# Altium schematic sheet 16.RK3588_MIPI  Interface.SchDoc
size 430 x 350 mm; Revision: V2.1; Schematic Page Number: 11; Page Number: 16; Check: <Checker>; Schematic Name: RK_NVR_DEMO1_RK3588_LP4/4x_V21; Page Count: 43; Page name: 16.RK3588_MIPI  Interface; Designer: Zhangdz; Schematic Page Count: 99; Revcode: V2.1; DsnPath: E:\Work\SBER\RK3588_SOM\temp\RK_NVR_DEMO1_RK3588_LP4XD200P232SD8_V21_20211228.DSN; SchematicName: RK_NVR_DEMO1_RK3588_LP4/4x_V21; PageName: 16.RK3588_MIPI  Interface; PageSize: Custom; TopSchematic: True
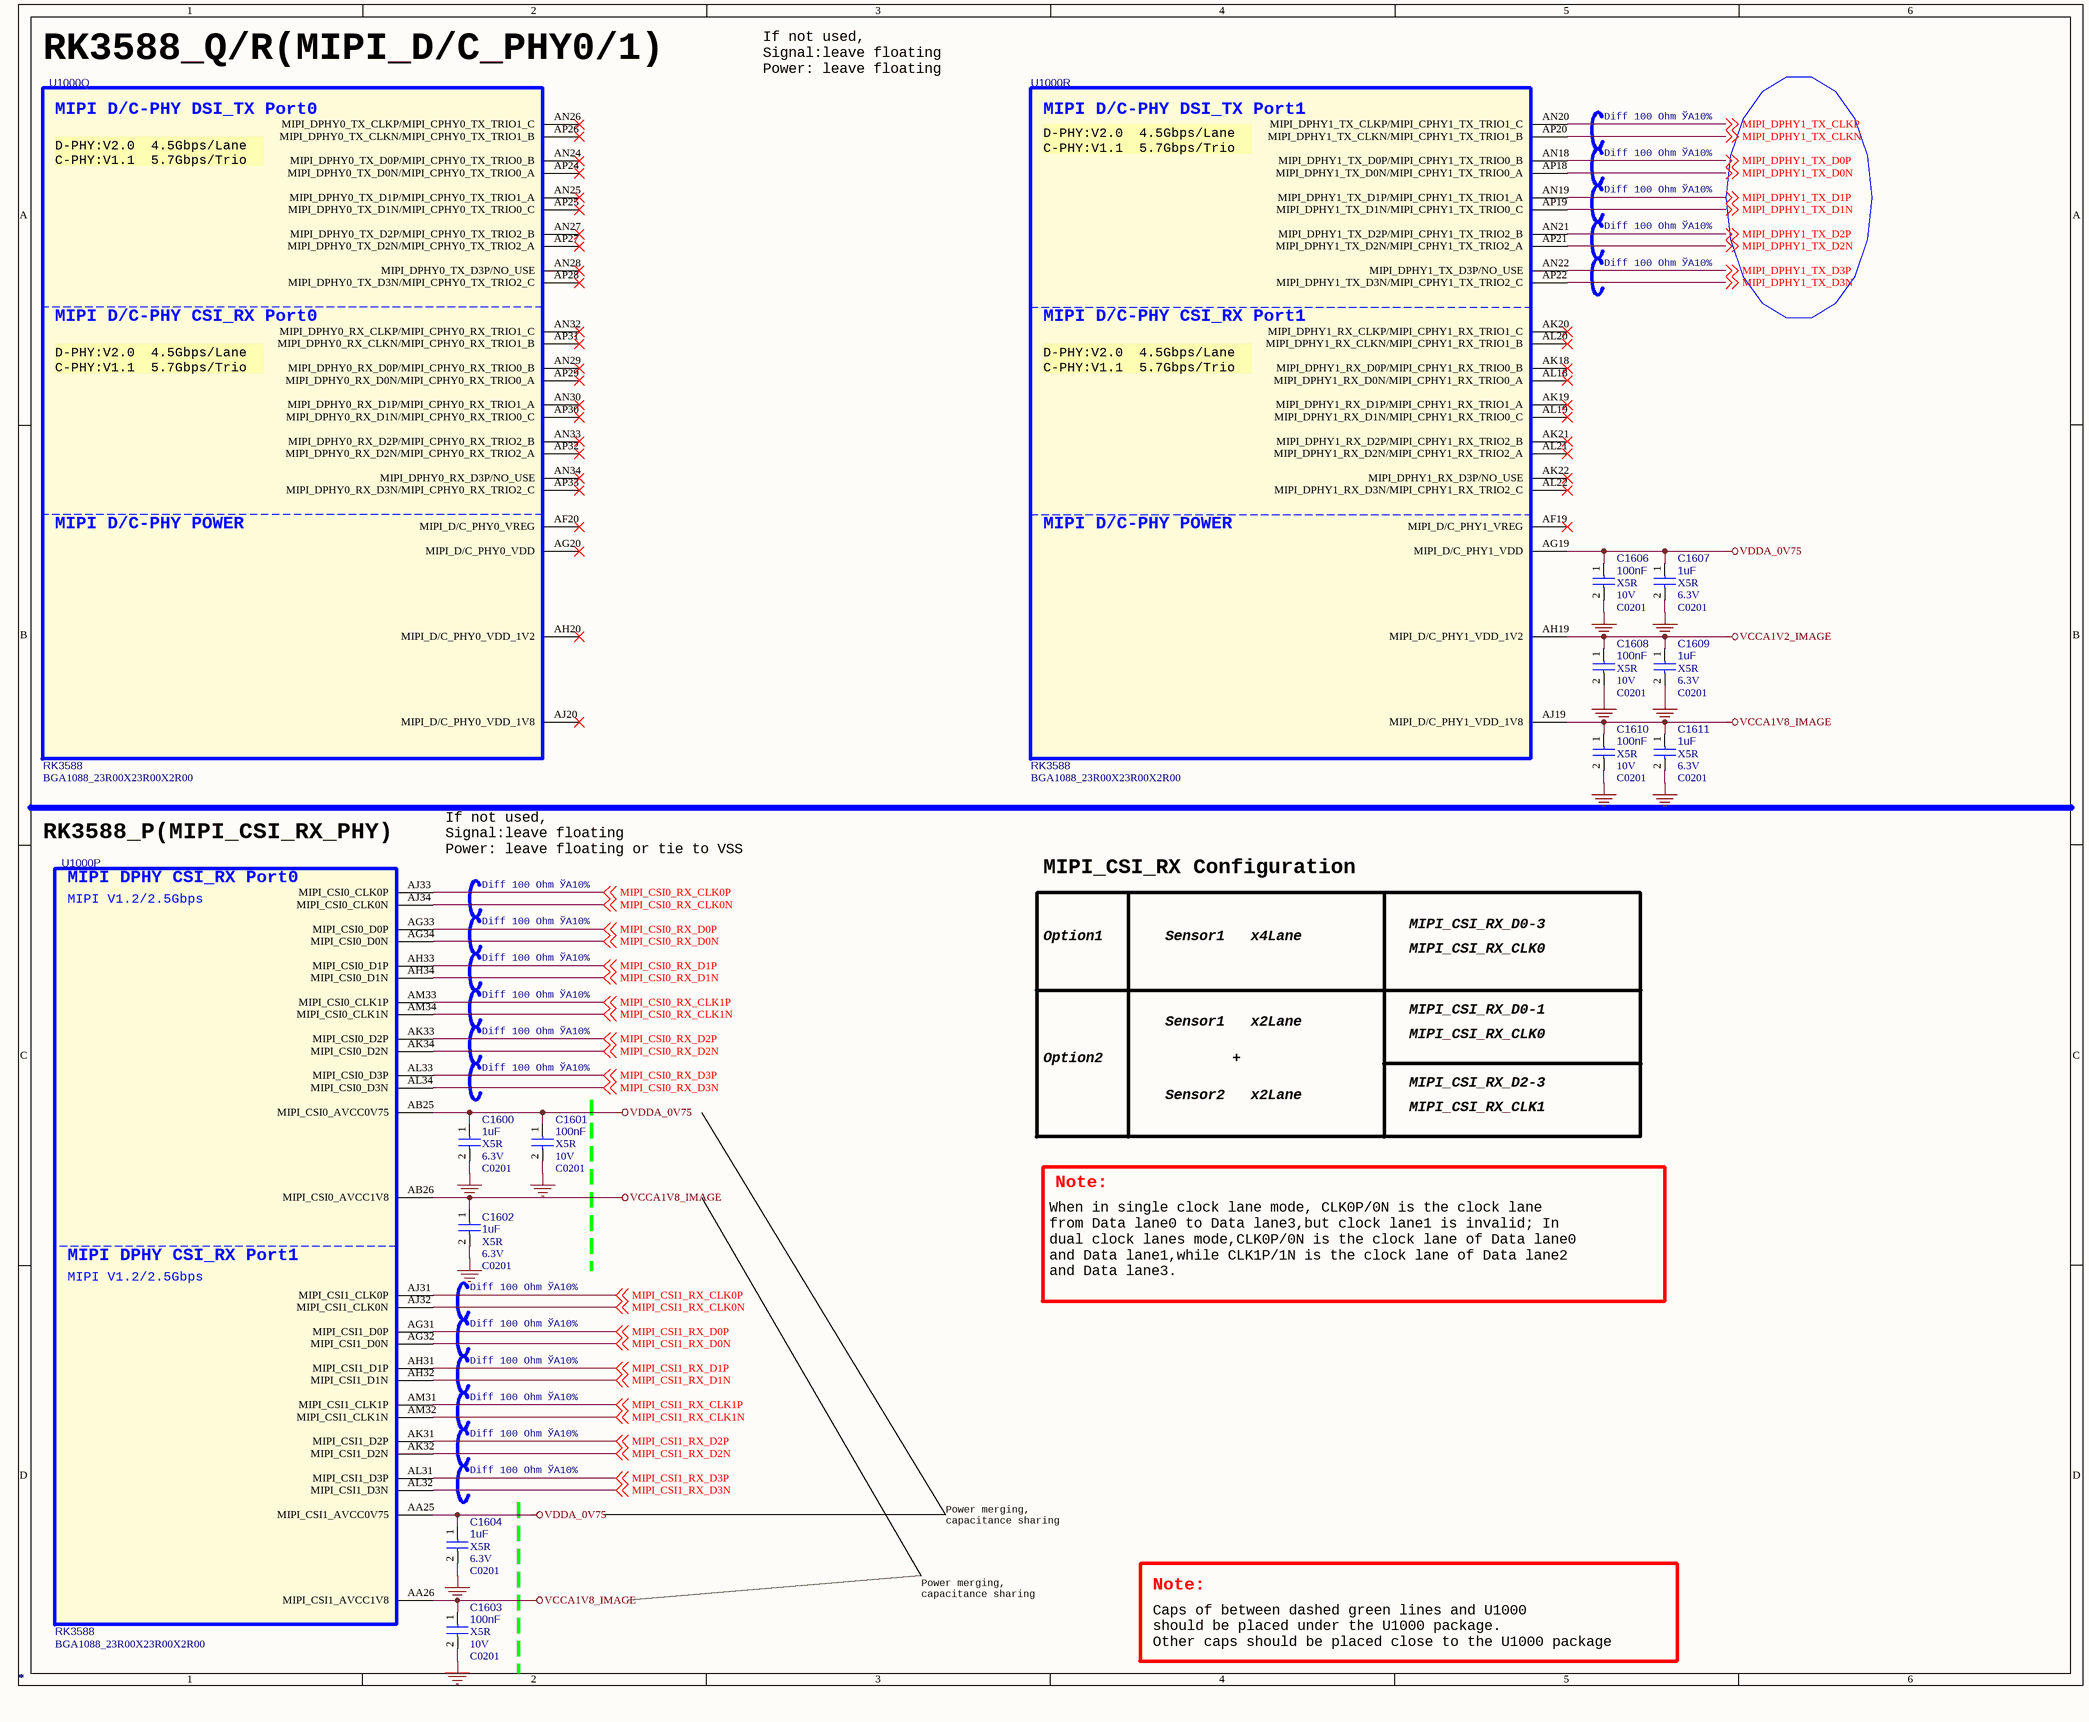
[diagram p0: 16.RK3588_MIPI  Interface.SchDoc]

## Parts
C1600  *  Voltage: 6.3V  Dielectric: X5R  [C0201]
C1601  *  Voltage: 10V  Dielectric: X5R  [C0201]
C1602  *  Voltage: 6.3V  Dielectric: X5R  [C0201]
C1603  *  Voltage: 10V  Dielectric: X5R  [C0201]
C1604  *  Voltage: 6.3V  Dielectric: X5R  [C0201]
C1606  *  Voltage: 10V  Dielectric: X5R  [C0201]
C1607  *  Voltage: 6.3V  Dielectric: X5R  [C0201]
C1608  *  Voltage: 10V  Dielectric: X5R  [C0201]
C1609  *  Voltage: 6.3V  Dielectric: X5R  [C0201]
C1610  *  Voltage: 10V  Dielectric: X5R  [C0201]
C1611  *  Voltage: 6.3V  Dielectric: X5R  [C0201]
U1000  *  [BGA1088_23R00X23R00X2R00]  (parts P,Q,R of 26)

## Nets
GND: C1600.2 C1601.2 C1602.2 C1603.2 C1604.2 C1606.2 C1607.2 C1608.2 C1609.2 C1610.2 C1611.2
VCCA1V2_IMAGE: C1608.1 C1609.1 U1000.AH19(MIPI_D/C_PHY1_VDD_1V2)
VCCA1V8_IMAGE: C1602.1 C1603.1 C1610.1 C1611.1 U1000.AA26(MIPI_CSI1_AVCC1V8) U1000.AB26(MIPI_CSI0_AVCC1V8) U1000.AJ19(MIPI_D/C_PHY1_VDD_1V8)
VDDA_0V75: C1600.1 C1601.1 C1604.1 C1606.1 C1607.1 U1000.AA25(MIPI_CSI1_AVCC0V75) U1000.AB25(MIPI_CSI0_AVCC0V75) U1000.AG19(MIPI_D/C_PHY1_VDD)
MIPI_CSI0_RX_CLK0N: U1000.AJ34(MIPI_CSI0_CLK0N) ; off-sheet MIPI_CSI0_RX_CLK0N
MIPI_CSI0_RX_CLK0P: U1000.AJ33(MIPI_CSI0_CLK0P) ; off-sheet MIPI_CSI0_RX_CLK0P
MIPI_CSI0_RX_CLK1N: U1000.AM34(MIPI_CSI0_CLK1N) ; off-sheet MIPI_CSI0_RX_CLK1N
MIPI_CSI0_RX_CLK1P: U1000.AM33(MIPI_CSI0_CLK1P) ; off-sheet MIPI_CSI0_RX_CLK1P
MIPI_CSI0_RX_D0N: U1000.AG34(MIPI_CSI0_D0N) ; off-sheet MIPI_CSI0_RX_D0N
MIPI_CSI0_RX_D0P: U1000.AG33(MIPI_CSI0_D0P) ; off-sheet MIPI_CSI0_RX_D0P
MIPI_CSI0_RX_D1N: U1000.AH34(MIPI_CSI0_D1N) ; off-sheet MIPI_CSI0_RX_D1N
MIPI_CSI0_RX_D1P: U1000.AH33(MIPI_CSI0_D1P) ; off-sheet MIPI_CSI0_RX_D1P
MIPI_CSI0_RX_D2N: U1000.AK34(MIPI_CSI0_D2N) ; off-sheet MIPI_CSI0_RX_D2N
MIPI_CSI0_RX_D2P: U1000.AK33(MIPI_CSI0_D2P) ; off-sheet MIPI_CSI0_RX_D2P
MIPI_CSI0_RX_D3N: U1000.AL34(MIPI_CSI0_D3N) ; off-sheet MIPI_CSI0_RX_D3N
MIPI_CSI0_RX_D3P: U1000.AL33(MIPI_CSI0_D3P) ; off-sheet MIPI_CSI0_RX_D3P
MIPI_CSI1_RX_CLK0N: U1000.AJ32(MIPI_CSI1_CLK0N) ; off-sheet MIPI_CSI1_RX_CLK0N
MIPI_CSI1_RX_CLK0P: U1000.AJ31(MIPI_CSI1_CLK0P) ; off-sheet MIPI_CSI1_RX_CLK0P
MIPI_CSI1_RX_CLK1N: U1000.AM32(MIPI_CSI1_CLK1N) ; off-sheet MIPI_CSI1_RX_CLK1N
MIPI_CSI1_RX_CLK1P: U1000.AM31(MIPI_CSI1_CLK1P) ; off-sheet MIPI_CSI1_RX_CLK1P
MIPI_CSI1_RX_D0N: U1000.AG32(MIPI_CSI1_D0N) ; off-sheet MIPI_CSI1_RX_D0N
MIPI_CSI1_RX_D0P: U1000.AG31(MIPI_CSI1_D0P) ; off-sheet MIPI_CSI1_RX_D0P
MIPI_CSI1_RX_D1N: U1000.AH32(MIPI_CSI1_D1N) ; off-sheet MIPI_CSI1_RX_D1N
MIPI_CSI1_RX_D1P: U1000.AH31(MIPI_CSI1_D1P) ; off-sheet MIPI_CSI1_RX_D1P
MIPI_CSI1_RX_D2N: U1000.AK32(MIPI_CSI1_D2N) ; off-sheet MIPI_CSI1_RX_D2N
MIPI_CSI1_RX_D2P: U1000.AK31(MIPI_CSI1_D2P) ; off-sheet MIPI_CSI1_RX_D2P
MIPI_CSI1_RX_D3N: U1000.AL32(MIPI_CSI1_D3N) ; off-sheet MIPI_CSI1_RX_D3N
MIPI_CSI1_RX_D3P: U1000.AL31(MIPI_CSI1_D3P) ; off-sheet MIPI_CSI1_RX_D3P
MIPI_DPHY1_TX_CLKN: U1000.AP20(MIPI_DPHY1_TX_CLKN/MIPI_CPHY1_TX_TRIO1_B) ; off-sheet MIPI_DPHY1_TX_CLKN
MIPI_DPHY1_TX_CLKP: U1000.AN20(MIPI_DPHY1_TX_CLKP/MIPI_CPHY1_TX_TRIO1_C) ; off-sheet MIPI_DPHY1_TX_CLKP
MIPI_DPHY1_TX_D0N: U1000.AP18(MIPI_DPHY1_TX_D0N/MIPI_CPHY1_TX_TRIO0_A) ; off-sheet MIPI_DPHY1_TX_D0N
MIPI_DPHY1_TX_D0P: U1000.AN18(MIPI_DPHY1_TX_D0P/MIPI_CPHY1_TX_TRIO0_B) ; off-sheet MIPI_DPHY1_TX_D0P
MIPI_DPHY1_TX_D1N: U1000.AP19(MIPI_DPHY1_TX_D1N/MIPI_CPHY1_TX_TRIO0_C) ; off-sheet MIPI_DPHY1_TX_D1N
MIPI_DPHY1_TX_D1P: U1000.AN19(MIPI_DPHY1_TX_D1P/MIPI_CPHY1_TX_TRIO1_A) ; off-sheet MIPI_DPHY1_TX_D1P
MIPI_DPHY1_TX_D2N: U1000.AP21(MIPI_DPHY1_TX_D2N/MIPI_CPHY1_TX_TRIO2_A) ; off-sheet MIPI_DPHY1_TX_D2N
MIPI_DPHY1_TX_D2P: U1000.AN21(MIPI_DPHY1_TX_D2P/MIPI_CPHY1_TX_TRIO2_B) ; off-sheet MIPI_DPHY1_TX_D2P
MIPI_DPHY1_TX_D3N: U1000.AP22(MIPI_DPHY1_TX_D3N/MIPI_CPHY1_TX_TRIO2_C) ; off-sheet MIPI_DPHY1_TX_D3N
MIPI_DPHY1_TX_D3P: U1000.AN22(MIPI_DPHY1_TX_D3P/NO_USE) ; off-sheet MIPI_DPHY1_TX_D3P

Not connected (* = marked no-connect by the designer): U1000 AF19(MIPI_D/C_PHY1_VREG)* AF20(MIPI_D/C_PHY0_VREG)* AG20(MIPI_D/C_PHY0_VDD)* AH20(MIPI_D/C_PHY0_VDD_1V2)* AJ20(MIPI_D/C_PHY0_VDD_1V8)* AK18(MIPI_DPHY1_RX_D0P/MIPI_CPHY1_RX_TRIO0_B)* AK19(MIPI_DPHY1_RX_D1P/MIPI_CPHY1_RX_TRIO1_A)* AK20(MIPI_DPHY1_RX_CLKP/MIPI_CPHY1_RX_TRIO1_C)* AK21(MIPI_DPHY1_RX_D2P/MIPI_CPHY1_RX_TRIO2_B)* AK22(MIPI_DPHY1_RX_D3P/NO_USE)* AL18(MIPI_DPHY1_RX_D0N/MIPI_CPHY1_RX_TRIO0_A)* AL19(MIPI_DPHY1_RX_D1N/MIPI_CPHY1_RX_TRIO0_C)* AL20(MIPI_DPHY1_RX_CLKN/MIPI_CPHY1_RX_TRIO1_B)* AL21(MIPI_DPHY1_RX_D2N/MIPI_CPHY1_RX_TRIO2_A)* AL22(MIPI_DPHY1_RX_D3N/MIPI_CPHY1_RX_TRIO2_C)* AN24(MIPI_DPHY0_TX_D0P/MIPI_CPHY0_TX_TRIO0_B)* AN25(MIPI_DPHY0_TX_D1P/MIPI_CPHY0_TX_TRIO1_A)* AN26(MIPI_DPHY0_TX_CLKP/MIPI_CPHY0_TX_TRIO1_C)* AN27(MIPI_DPHY0_TX_D2P/MIPI_CPHY0_TX_TRIO2_B)* AN28(MIPI_DPHY0_TX_D3P/NO_USE)* AN29(MIPI_DPHY0_RX_D0P/MIPI_CPHY0_RX_TRIO0_B)* AN30(MIPI_DPHY0_RX_D1P/MIPI_CPHY0_RX_TRIO1_A)* AN32(MIPI_DPHY0_RX_CLKP/MIPI_CPHY0_RX_TRIO1_C)* AN33(MIPI_DPHY0_RX_D2P/MIPI_CPHY0_RX_TRIO2_B)* AN34(MIPI_DPHY0_RX_D3P/NO_USE)* AP24(MIPI_DPHY0_TX_D0N/MIPI_CPHY0_TX_TRIO0_A)* AP25(MIPI_DPHY0_TX_D1N/MIPI_CPHY0_TX_TRIO0_C)* AP26(MIPI_DPHY0_TX_CLKN/MIPI_CPHY0_TX_TRIO1_B)* AP27(MIPI_DPHY0_TX_D2N/MIPI_CPHY0_TX_TRIO2_A)* AP28(MIPI_DPHY0_TX_D3N/MIPI_CPHY0_TX_TRIO2_C)* AP29(MIPI_DPHY0_RX_D0N/MIPI_CPHY0_RX_TRIO0_A)* AP30(MIPI_DPHY0_RX_D1N/MIPI_CPHY0_RX_TRIO0_C)* AP31(MIPI_DPHY0_RX_CLKN/MIPI_CPHY0_RX_TRIO1_B)* AP32(MIPI_DPHY0_RX_D2N/MIPI_CPHY0_RX_TRIO2_A)* AP33(MIPI_DPHY0_RX_D3N/MIPI_CPHY0_RX_TRIO2_C)*

## Notes on the sheet
- RK3588_Q/R(MIPI_D/C_PHY0/1)
- If not used,
  Signal:leave floating
  Power: leave floating
- Diff 100 Ohm ЎА10%
- RK3588_P(MIPI_CSI_RX_PHY)
- If not used,
  Signal:leave floating
  Power: leave floating or tie to VSS
- MIPI_CSI_RX Configuration
- Option1
- Sensor1
- x4Lane
- MIPI_CSI_RX_D0-3
- MIPI_CSI_RX_CLK0
- x2Lane
- MIPI_CSI_RX_D0-1
- Option2
- Sensor2
- +
- MIPI_CSI_RX_D2-3
- MIPI_CSI_RX_CLK1
- Note:
- When in single clock lane mode, CLK0P/0N is the clock lane
  from Data lane0 to Data lane3,but clock lane1 is invalid; In
  dual clock lanes mode,CLK0P/0N is the clock lane of Data lane0
  and Data lane1,while CLK1P/1N is the clock lane of Data lane2
  and Data lane3.
- Power merging,
  capacitance sharing
- Caps of between dashed green lines and U1000
  should be placed under the U1000 package.
  Other caps should be placed close to the U1000 package
- (in symbol SOC_RK3588, part P) MIPI DPHY CSI_RX Port0; MIPI V1.2/2.5Gbps; MIPI DPHY CSI_RX Port1
- (in symbol SOC_RK3588, part Q) MIPI D/C-PHY DSI_TX Port0; D-PHY:V2.0  4.5Gbps/Lane / C-PHY:V1.1  5.7Gbps/Trio; MIPI D/C-PHY CSI_RX Port0; MIPI D/C-PHY POWER
- (in symbol SOC_RK3588, part R) MIPI D/C-PHY DSI_TX Port1; D-PHY:V2.0  4.5Gbps/Lane / C-PHY:V1.1  5.7Gbps/Trio; MIPI D/C-PHY CSI_RX Port1; MIPI D/C-PHY POWER

## Library data of the parts
C1600 = CAP NP: cap,1.00uF,+/-20%,6.3V,X5R,C0201; Part Reference: C1600; Manufacturer: TDK; Value: 1uF; RK PN: C0603X5R0J105M030BC; Priority: A; Tolerance: 20%; PCB Footprint: C0201; Part Type: C0201; Manufacturer PN: C0603X5R0J105M030BC; Created by: JJJ
C1601 = CAP NP: cap,100.00nF,+/-10%,10V,X5R,C0201; Part Reference: C1601; Manufacturer: TDK; Value: 100nF; RK PN: C0603X5R1A104K030BC; Priority: A; Tolerance: 10%; PCB Footprint: C0201; Part Type: C0201; Manufacturer PN: C0603X5R1A104K030BC; Created by: JJJ
C1602 = CAP NP: cap,1.00uF,+/-20%,6.3V,X5R,C0201; Part Reference: C1602; Manufacturer: TDK; Value: 1uF; RK PN: C0603X5R0J105M030BC; Priority: A; Tolerance: 20%; PCB Footprint: C0201; Part Type: C0201; Manufacturer PN: C0603X5R0J105M030BC; Created by: JJJ
C1603 = CAP NP: cap,100.00nF,+/-10%,10V,X5R,C0201; Part Reference: C1603; Manufacturer: TDK; Value: 100nF; RK PN: C0603X5R1A104K030BC; Priority: A; Tolerance: 10%; PCB Footprint: C0201; Part Type: C0201; Manufacturer PN: C0603X5R1A104K030BC; Created by: JJJ
C1604 = CAP NP: cap,1.00uF,+/-20%,6.3V,X5R,C0201; Part Reference: C1604; Manufacturer PN: C0603X5R0J105M030BC; Manufacturer: TDK; Value: 1uF; Tolerance: 20%; Priority: A; PCB Footprint: C0201; Created by: JJJ; Part Type: C0201; RK PN: C0603X5R0J105M030BC
C1606 = CAP NP: cap,100.00nF,+/-10%,10V,X5R,C0201; Part Reference: C1606; Manufacturer PN: C0603X5R1A104K030BC; Manufacturer: TDK; Value: 100nF; Tolerance: 10%; Priority: A; PCB Footprint: C0201; Created by: JJJ; Part Type: C0201; RK PN: C0603X5R1A104K030BC
C1607 = CAP NP: cap,1.00uF,+/-20%,6.3V,X5R,C0201; Part Reference: C1607; Manufacturer: TDK; Value: 1uF; RK PN: C0603X5R0J105M030BC; Priority: A; Tolerance: 20%; PCB Footprint: C0201; Part Type: C0201; Manufacturer PN: C0603X5R0J105M030BC; Created by: JJJ
C1608 = CAP NP: cap,100.00nF,+/-10%,10V,X5R,C0201; Part Reference: C1608; Manufacturer PN: C0603X5R1A104K030BC; Manufacturer: TDK; Value: 100nF; Tolerance: 10%; Priority: A; PCB Footprint: C0201; Created by: JJJ; Part Type: C0201; RK PN: C0603X5R1A104K030BC
C1609 = CAP NP: cap,1.00uF,+/-20%,6.3V,X5R,C0201; Part Reference: C1609; Manufacturer: TDK; Value: 1uF; RK PN: C0603X5R0J105M030BC; Priority: A; Tolerance: 20%; PCB Footprint: C0201; Part Type: C0201; Manufacturer PN: C0603X5R0J105M030BC; Created by: JJJ
C1610 = CAP NP: cap,100.00nF,+/-10%,10V,X5R,C0201; Part Reference: C1610; Manufacturer PN: C0603X5R1A104K030BC; Manufacturer: TDK; Value: 100nF; Tolerance: 10%; Priority: A; PCB Footprint: C0201; Created by: JJJ; Part Type: C0201; RK PN: C0603X5R1A104K030BC
C1611 = CAP NP: cap,1.00uF,+/-20%,6.3V,X5R,C0201; Part Reference: C1611; Manufacturer: TDK; Value: 1uF; RK PN: C0603X5R0J105M030BC; Priority: A; Tolerance: 20%; PCB Footprint: C0201; Part Type: C0201; Manufacturer PN: C0603X5R0J105M030BC; Created by: JJJ
U1000 = SOC_RK3588: ROCKCHIP SOC; Part Reference: U1000; Manufacturer: Rockchip (ИрРѕОў); SPLIT_INST: TRUE; SWAP_INFO: (S1+S2+S3+S4+S5+S6+S7+S8+S9+S10+S11+S12+S13+S14+S15+S16+S17+S18+S19+S20+S21+S22+S23+S24+S25+S26); Value: RK3588; Priority: A; RK PN: RK3588; Part Type: SOC; Manufacturer PN: RK3588; Created by: YWQ; PCB Footprint: BGA1088_23R00X23R00X2R00